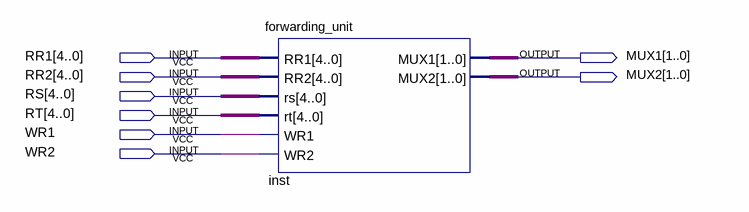
[diagram p0: schematic sheet]
// Quartus schematic fu_TEST.bdf as structural Verilog: 1 symbols, 8 pins
module fu_TEST (
  input  [4:0] RR1,
  input  [4:0] RR2,
  input  [4:0] RS,
  input  [4:0] RT,
  input  WR1,
  input  WR2,
  output [1:0] MUX1,
  output [1:0] MUX2
);

  forwarding_unit inst (.RR1(RR1), .RR2(RR2), .rs(RS), .rt(RT), .WR1(WR1), .WR2(WR2), .MUX1(MUX1), .MUX2(MUX2));
endmodule
